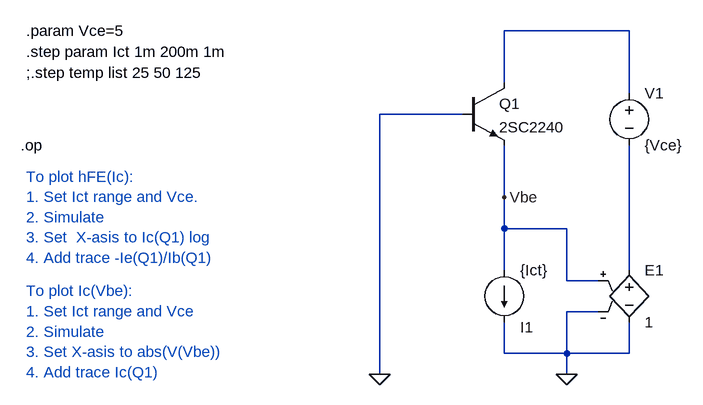
[diagram p0: schematic NPN - hFE(Ic), Ic(Vbe).asc]
NPN - hFE(Ic), Ic(Vbe).asc, the LTspice schematic file:
Version 4
SHEET 1 880 680
WIRE 128 -240 -64 -240
WIRE -64 -160 -64 -240
WIRE 128 -144 128 -240
WIRE -128 -112 -256 -112
WIRE -64 16 -64 -64
WIRE -64 64 -64 16
WIRE 32 64 -64 64
WIRE -64 128 -64 64
WIRE 128 128 128 -64
WIRE 32 144 32 64
WIRE 80 144 32 144
WIRE 80 192 32 192
WIRE -64 256 -64 208
WIRE 32 256 32 192
WIRE 32 256 -64 256
WIRE 128 256 128 208
WIRE 128 256 32 256
WIRE -256 288 -256 -112
WIRE 32 288 32 256
FLAG -256 288 0
FLAG 32 288 0
FLAG -64 16 Vbe
SYMBOL npn -128 -160 R0
SYMATTR InstName Q1
SYMATTR Value 2SC2240
SYMBOL voltage 128 -160 R0
WINDOW 123 0 0 Left 0
WINDOW 39 0 0 Left 0
SYMATTR InstName V1
SYMATTR Value {Vce}
SYMBOL current -64 128 R0
WINDOW 0 24 88 Left 0
WINDOW 3 24 0 Left 0
WINDOW 123 0 0 Left 0
WINDOW 39 0 0 Left 0
SYMATTR InstName I1
SYMATTR Value {Ict}
SYMBOL e 128 112 R0
SYMATTR InstName E1
SYMATTR Value 1
TEXT -800 -240 Left 0 !.param Vce=5
TEXT -800 -208 Left 0 !.step param Ict 1m 200m 1m
TEXT -808 -64 Left 0 !.op
TEXT -800 -176 Left 0 !;.step temp list 25 50 125
TEXT -800 -16 Left 0 ;To plot hFE(Ic):\n1. Set Ict range and Vce.\n2. Simulate\n3. Set  X-asis to Ic(Q1) log\n4. Add trace -Ie(Q1)/Ib(Q1)
TEXT -800 160 Left 0 ;To plot Ic(Vbe):\n1. Set Ict range and Vce\n2. Simulate\n3. Set X-asis to abs(V(Vbe))\n4. Add trace Ic(Q1)

The netlist it stands for:
* NPN - hFE(Ic), Ic(Vbe).asc
Q1 N001 0 Vbe 0 2SC2240
V1 N001 N002 {Vce}
I1 Vbe 0 {Ict}
E1 N002 0 Vbe 0 1
.model NPN NPN
.model PNP PNP
.lib standard.bjt
.param Vce=5
.step param Ict 1m 200m 1m
.op
;.step temp list 25 50 125
* To plot hFE(Ic):
* 1. Set Ict range and Vce.
* 2. Simulate
* 3. Set  X-asis to Ic(Q1) log
* 4. Add trace -Ie(Q1)/Ib(Q1)
* To plot Ic(Vbe):
* 1. Set Ict range and Vce
* 2. Simulate
* 3. Set X-asis to abs(V(Vbe))
* 4. Add trace Ic(Q1)
.backanno
.end